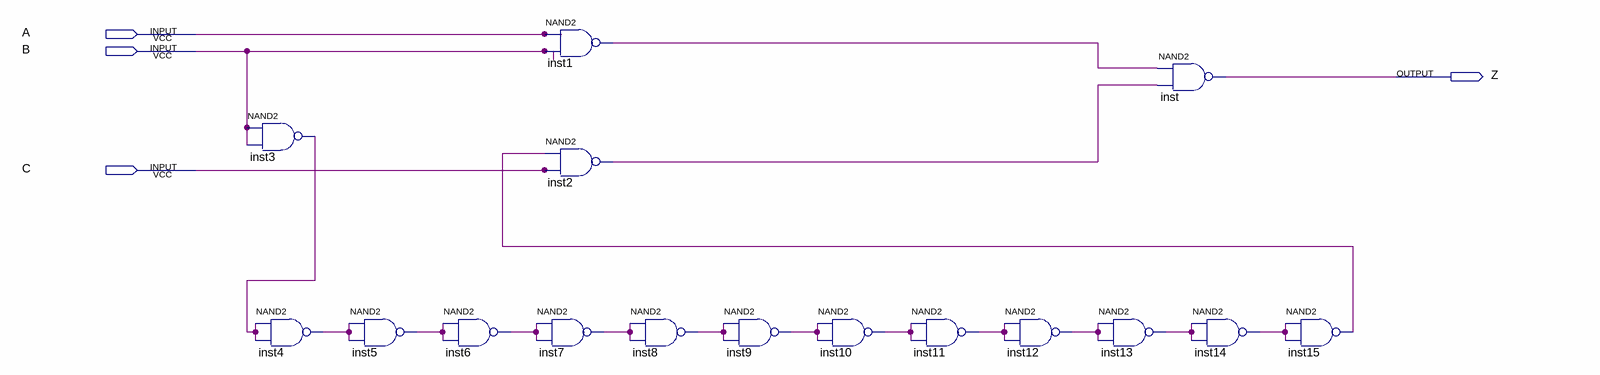
[diagram p0: schematic sheet]
// Quartus schematic lab1_inverter.bdf as structural Verilog: 16 symbols, 4 pins
module lab1_inverter (
  input  A,
  input  B,
  input  C,
  output Z
);

  wire inst1_out, inst2_out, inst3_out, inst4_out, inst5_out, inst6_out, inst7_out, inst8_out, inst9_out,
       inst10_out, inst11_out, inst12_out, inst13_out, inst14_out, inst15_out;

  nand inst3 (inst3_out, B, B);
  nand inst4 (inst4_out, inst3_out, inst3_out);
  nand inst5 (inst5_out, inst4_out, inst4_out);
  nand inst6 (inst6_out, inst5_out, inst5_out);
  nand inst1 (inst1_out, A, B);
  nand inst2 (inst2_out, inst15_out, C);
  nand inst7 (inst7_out, inst6_out, inst6_out);
  nand inst8 (inst8_out, inst7_out, inst7_out);
  nand inst9 (inst9_out, inst8_out, inst8_out);
  nand inst10 (inst10_out, inst9_out, inst9_out);
  nand inst11 (inst11_out, inst10_out, inst10_out);
  nand inst12 (inst12_out, inst11_out, inst11_out);
  nand inst13 (inst13_out, inst12_out, inst12_out);
  nand inst (Z, inst1_out, inst2_out);
  nand inst14 (inst14_out, inst13_out, inst13_out);
  nand inst15 (inst15_out, inst14_out, inst14_out);
endmodule
